# EAGLE design HB-WDS100-C6-O-2_WindDir_v1p0 (EAGLE 8.7.1)
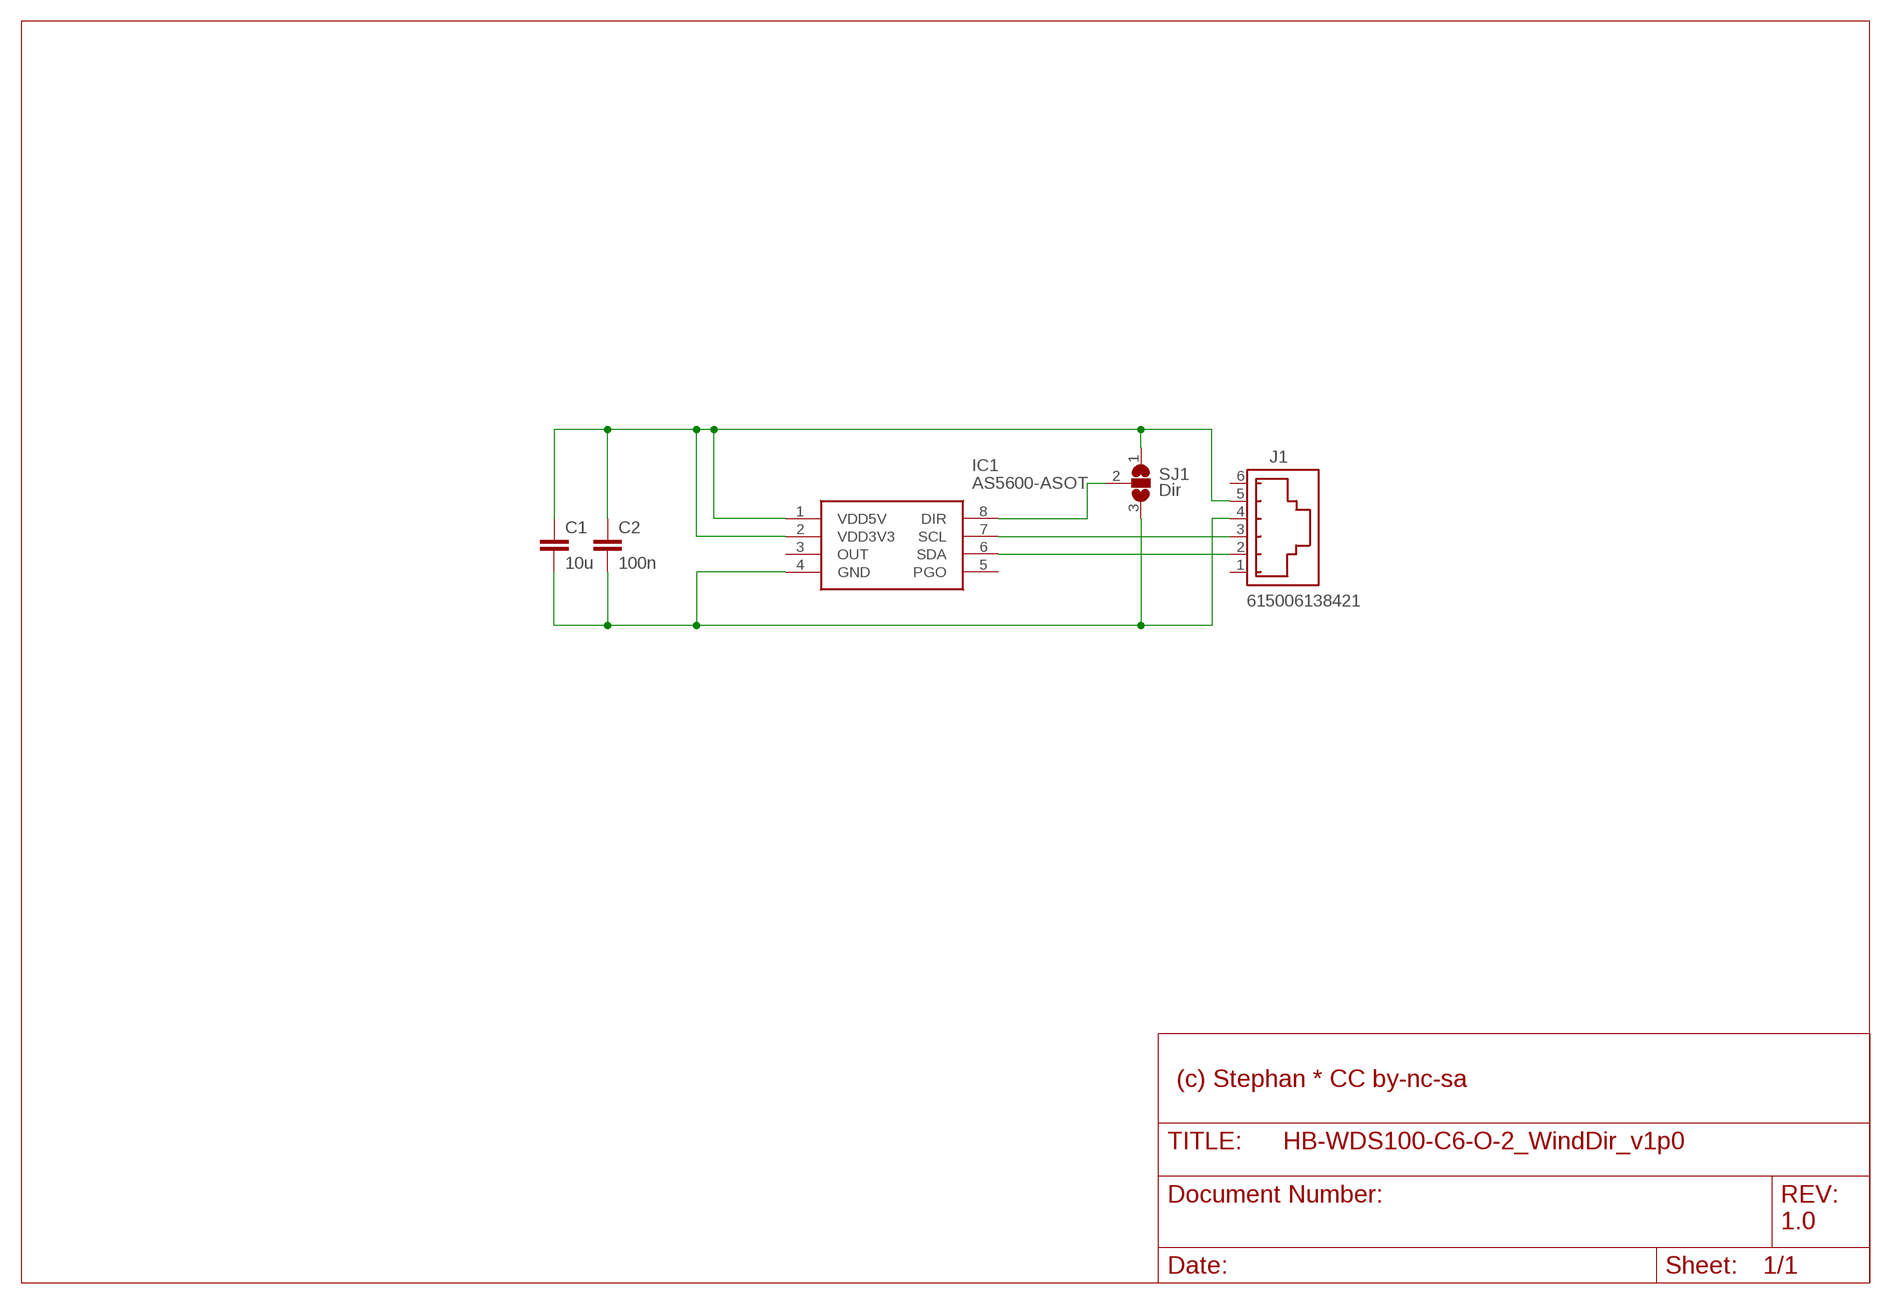
[diagram p0: schematic, sheet 1]

## Parts
C1  10u  C-EUC0805K  [C0805K]
C2  100n  C-EUC0805K  [C0805K]
IC1  AS5600-ASOT  [SOIC127P600X175-8N]
J1  615006138421  [615006138421]
SJ1  Dir  SJ2W  [SJ_2]

## Nets
3V3: C1.1 C2.1 IC1.1(VDD5V) IC1.2(VDD3V3) J1.5 SJ1.1
DIR: IC1.8(DIR) SJ1.2
GND: C1.2 C2.2 IC1.4(GND) J1.4 SJ1.3
SCL: IC1.7(SCL) J1.3
SDA: IC1.6(SDA) J1.2
Unconnected: IC1.3(OUT) IC1.5(PGO) J1.1 J1.6

## Notes on the sheet
- (c) Stephan * CC by-nc-sa
- 1.0

## Library data of the parts
C1 C2 = rcl:C-EU: CAPACITOR, European symbol; SPICEPREFIX: C
IC1 = SamacSys_Parts:AS5600-ASOT: Board Mount Hall Effect / Magnetic Sensors AS5600 Magnetic Sensor 12-Bit Source: Datasheet <http://www.ams.com/eng/content/download/639463/1698857/325295>; ARROW_PART_NUMBER: AS5600-ASOT; ARROW_PRICE-STOCK: https://www.arrow.com/en/products/as5600-asot/ams-ag; DESCRIPTION: Board Mount Hall Effect / Magnetic Sensors AS5600 Magnetic Sensor 12-Bit; HEIGHT: 1.75mm; MANUFACTURER_NAME: ams; MANUFACTURER_PART_NUMBER: AS5600-ASOT; MOUSER_PART_NUMBER: 985-AS5600-ASOT; MOUSER_PRICE-STOCK: https://www.mouser.co.uk/ProductDetail/ams/AS5600-ASOT/?qs=KTMMzrZdriGJpjhsnAEYBA%3D%3D
J1 = WuerthModular:615006138421: WR-MJ Modular Jack Horizontal Plastic 6PxC Tab Up KIND PROPERTIES Quality Class:500 Mating cycles General Information Operating Temperature:-40 up to +85 °C Compliance: RoHS Electrical Properties IR 1:1.5A Working Voltage:120V (AC) Withstanding Voltage:1000V (AC) Contact Resistance:20mΩ RISO:500 MΩ Material Properties Insulator MateriaL:PBT Insulator Flammability Rating:UL94 V-0 Color:Black Contact Material Copper Alloy Contact Plating:Gold Contact Type:Stamped Packaging Properties Packaging:Tray <https://www.we-online.com/catalog/media/o33138v209%20Family_WR-MJ_61500x138421.jpg> Details see: https://www.we-online.com/catalog/en/MJ_HORIZONTAL_PLASTIC_6PXC_TAB_UP/? Updated by Yingchun,Shan 2020-01-06 2020 (C) Würth Elektronik; DATASHEET-URL: https://www.we-online.com/catalog/datasheet/615006138421.pdf; MOUNT: THT; PART-NUMBER: 615006138421; TYPE: Horizontal; XPXC: 6P6C
SJ1 = jumper:SJ2W: SMD solder JUMPER

## Board
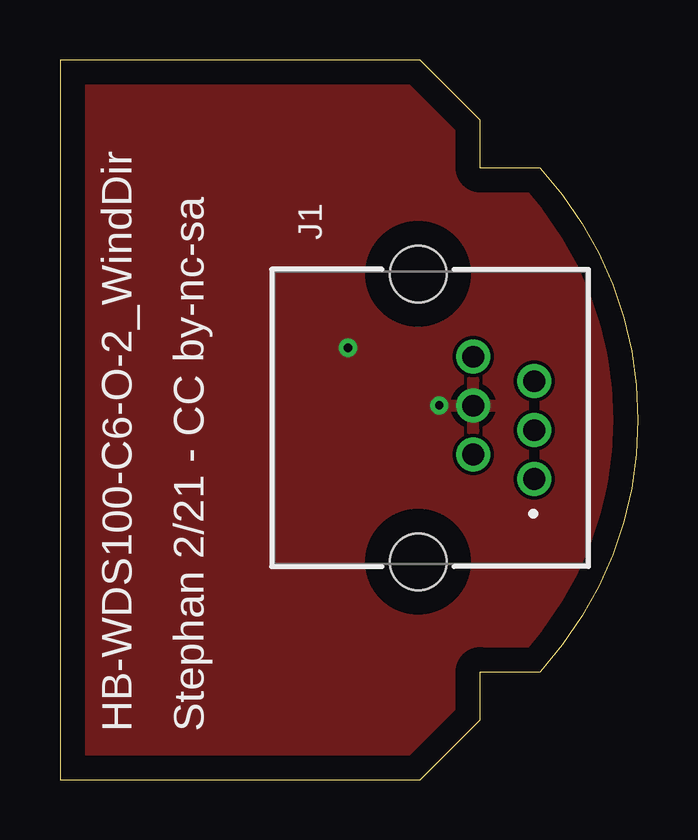
[diagram p1: board, top side]
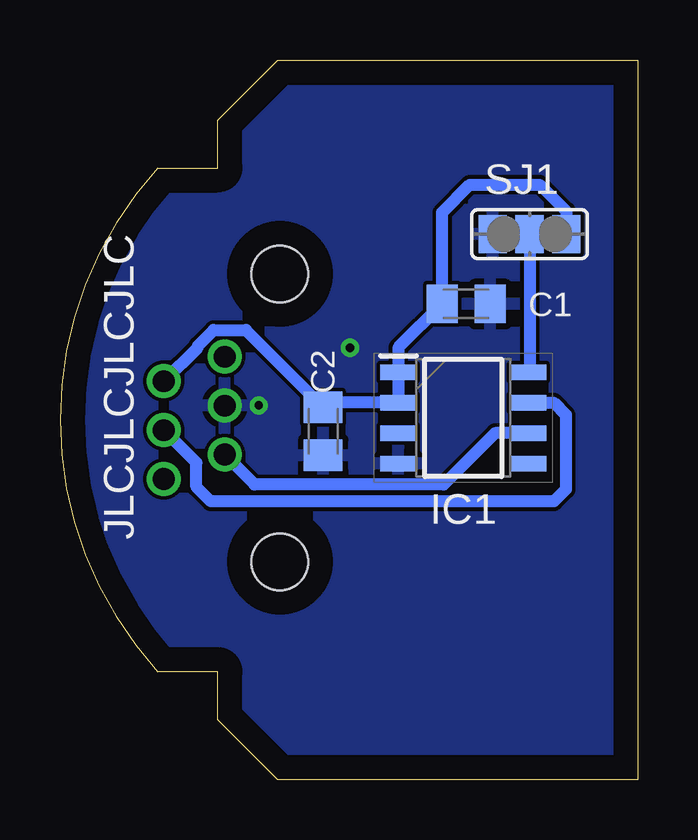
[diagram p2: board, bottom side, seen from below]

Size 24.08 x 30 mm. Coordinates in mm from the lower left corner, seen from the top.
Outline: 0,0 15,0 17.5,2.5 17.5,4.5 20,4.5 arc85 20,25.5 17.5,25.5 17.5,27.5 15,30 0,30 0,0
Copper layers (1*16): Top 0.035mm / dielectric 1.5mm / Bottom 0.035mm
Design rules "default": minimum track width 6mil, minimum drill 0.35mm, track to track 6mil, track to pad 6mil, pad to pad 6mil, via to via 6mil, smd to smd 6mil, copper to edge 40mil, drill to drill 6mil, minimum pad ring 10mil, minimum via ring 8mil, stop-mask expansion 4mil, vias tented up to drill 0mil, thermal gap 10mil

### Footprints (pad centres in the part's own frame; a part is rotated, then mirrored left to right if it is on the bottom)
C0805K = smd 1.3 x 1.6: 1 -1,0; 2 1,0
SOIC127P600X175-8N = smd 1.5 x 0.65: 1 -2.7,1.905; 2 -2.7,0.635; 3 -2.7,-0.635; 4 -2.7,-1.905; 5 2.7,-1.905; 6 2.7,-0.635; 7 2.7,0.635; 8 2.7,1.905
615006138421 = drill 0.9: 1 2.55,4.34; 2 1.53,1.8; 3 0.51,4.34; 4 -0.51,1.8; 5 -1.53,4.34; 6 -2.55,1.8 | hole 2.36: -6,-0.5; 6,-0.5
SJ_2 = smd 1.168 x 1.6: 1 -1.524,0; 2 0,0; 3 1.524,0

### Placement (x,y rotation side)
C1  7.16,19.83 0 bottom
C2  13.12,14.52 270 bottom
IC1  7.28,15.08 0 bottom
J1  15.42,15.08 270 top
SJ1  4.52,22.74 180 bottom

### Tracks (layer width: path | path; a pad name or v marks a point on that pad's centre or on a via)
3V3
  Bottom 0.508: J1.5 18.33,18.04 18.33,18.09 17.68,18.74 16.34,18.74 C2.1 12.93,15.71 IC1.2 IC1.1 9.98,18.01 C1.1 8.16,23.64 7,24.8 4.1,24.8 3,23.7 SJ1.1
DIR
  Bottom 0.508: SJ1.2 4.52,17.05 IC1.8
GND  (via drill 0.35)
  other vias: 15.8,15.6 12,18
  pour Bottom: -0.7,30.4 24.5,30.4 24.5,-0.4 -0.7,-0.3
  pour Top: 0,30 24,30 24,0 -1,0 -1,30
SCL
  Bottom 0.508: IC1.7 3.52,15.71 3,15.2 3,12.1 3.5,11.6 17.8,11.6 18.4,12.2 18.4,13.21 J1.3
SDA
  Bottom 0.508: IC1.6 5.96,14.45 8.1,12.3 15.97,12.3 J1.2

### Text on the board
tNames: HB-WDS100-C6-O-2_WindDir | Stephan 2/21 - CC by-nc-sa
bNames: JLCJLCJLCJLC